# Altium schematic sheet PIC32MZDA.SchDoc
size B; SheetNumber: 2; SheetTotal: 5
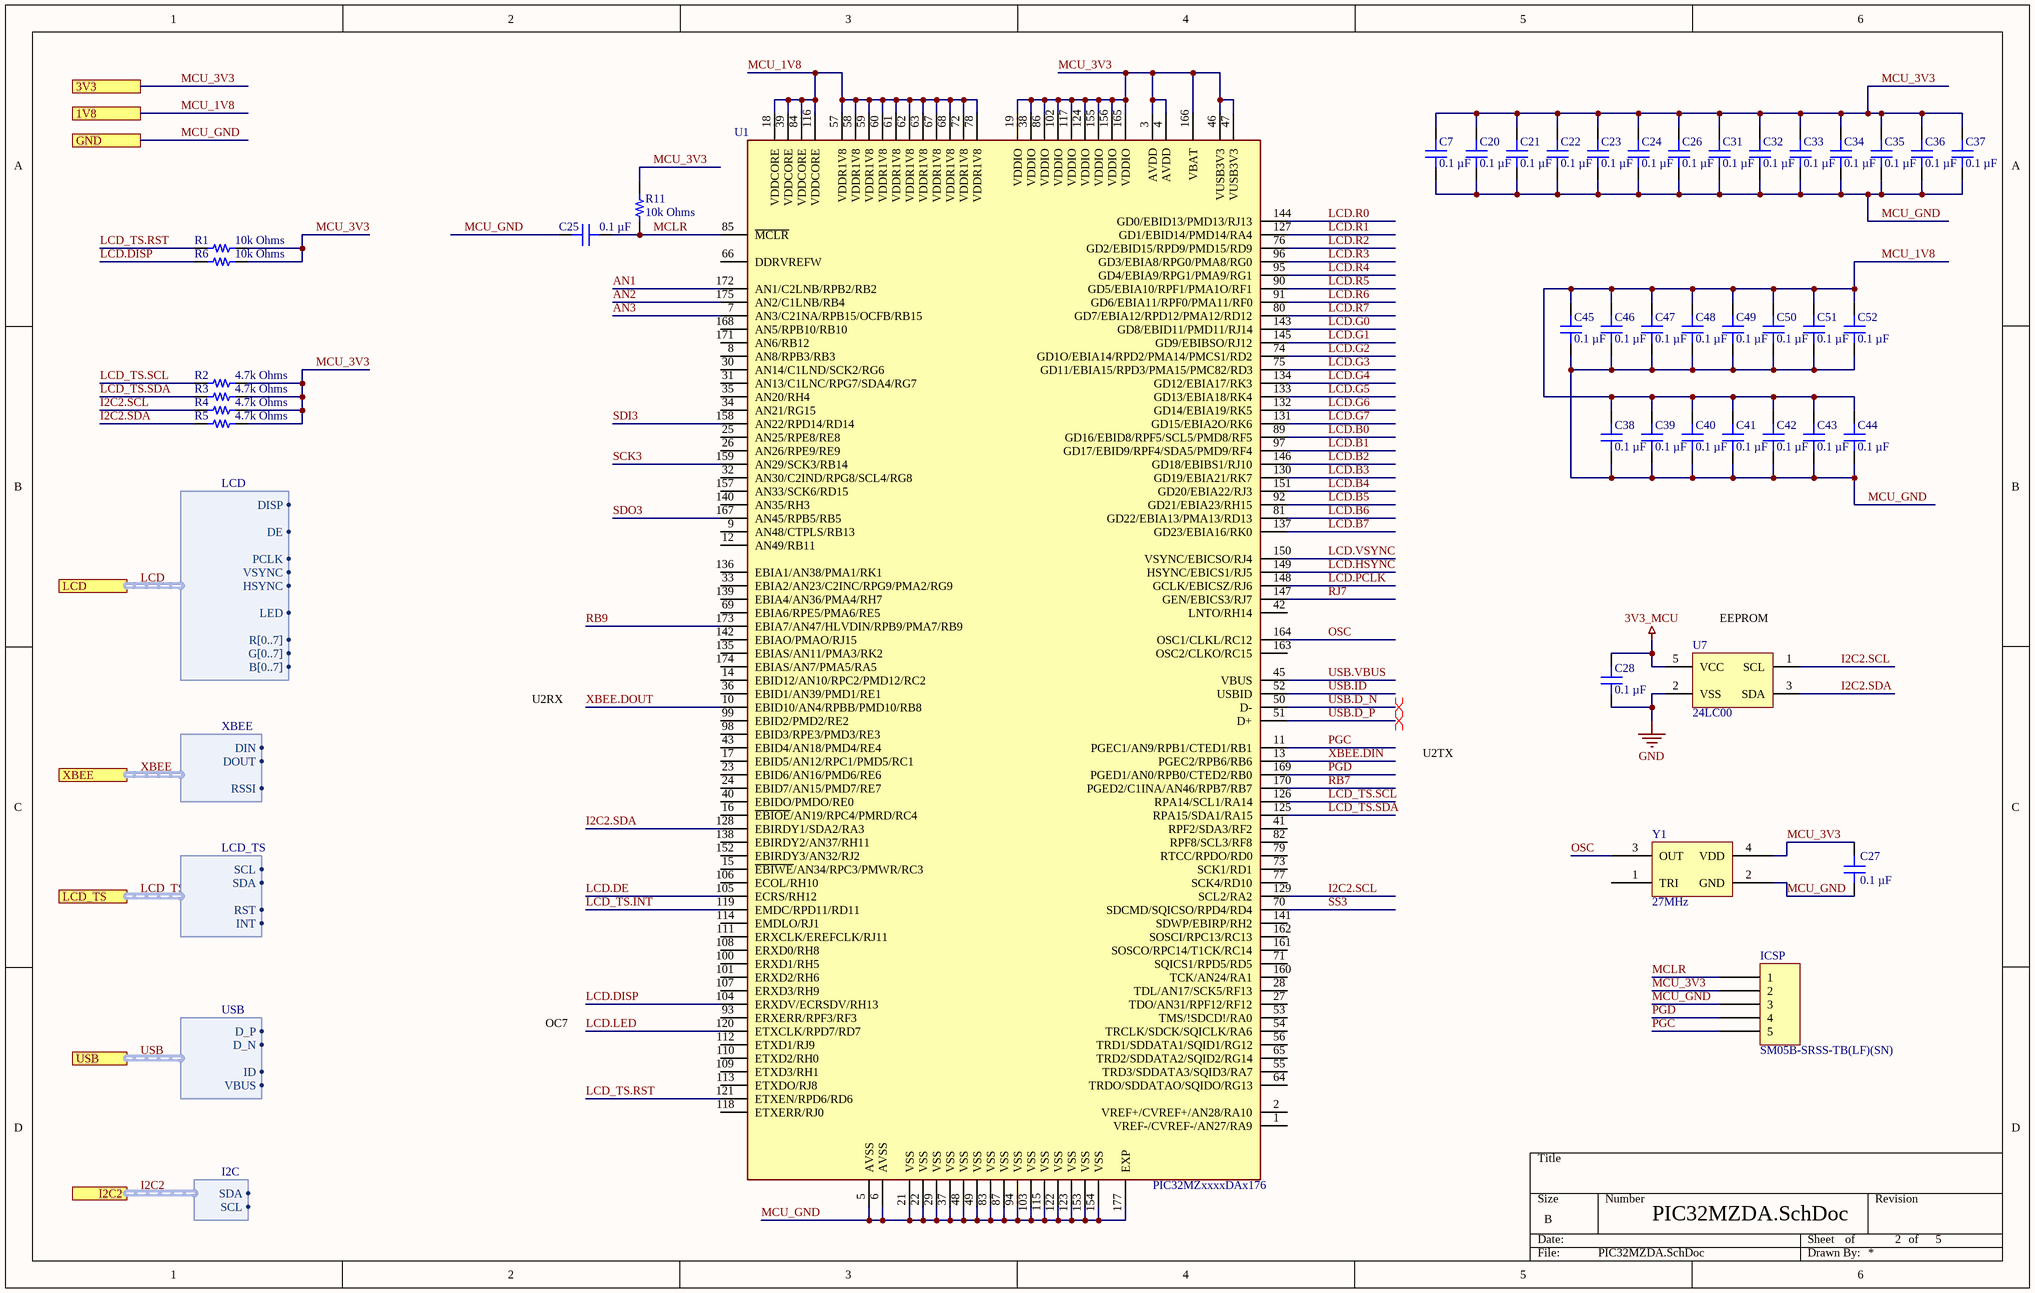
[diagram p0: PIC32MZDA.SchDoc]

## Parts
C7  0.1 µF  [CAP 0402_1005]
C20  0.1 µF  [CAP 0402_1005]
C21  0.1 µF  [CAP 0402_1005]
C22  0.1 µF  [CAP 0402_1005]
C23  0.1 µF  [CAP 0402_1005]
C24  0.1 µF  [CAP 0402_1005]
C25  0.1 µF  [CAP 0402_1005]
C26  0.1 µF  [CAP 0402_1005]
C27  0.1 µF  [CAP 0402_1005]
C28  0.1 µF  [CAP 0402_1005]
C31  0.1 µF  [CAP 0402_1005]
C32  0.1 µF  [CAP 0402_1005]
C33  0.1 µF  [CAP 0402_1005]
C34  0.1 µF  [CAP 0402_1005]
C35  0.1 µF  [CAP 0402_1005]
C36  0.1 µF  [CAP 0402_1005]
C37  0.1 µF  [CAP 0402_1005]
C38  0.1 µF  [CAP 0402_1005]
C39  0.1 µF  [CAP 0402_1005]
C40  0.1 µF  [CAP 0402_1005]
C41  0.1 µF  [CAP 0402_1005]
C42  0.1 µF  [CAP 0402_1005]
C43  0.1 µF  [CAP 0402_1005]
C44  0.1 µF  [CAP 0402_1005]
C45  0.1 µF  [CAP 0402_1005]
C46  0.1 µF  [CAP 0402_1005]
C47  0.1 µF  [CAP 0402_1005]
C48  0.1 µF  [CAP 0402_1005]
C49  0.1 µF  [CAP 0402_1005]
C50  0.1 µF  [CAP 0402_1005]
C51  0.1 µF  [CAP 0402_1005]
C52  0.1 µF  [CAP 0402_1005]
ICSP  SM05B-SRSS-TB(LF)(SN)  [JST SM05B-SRSS-TB]
R1  10k Ohms  [RES 0402_1005]
R2  4.7k Ohms  [RES 0402_1005]
R3  4.7k Ohms  [RES 0402_1005]
R4  4.7k Ohms  [RES 0402_1005]
R5  4.7k Ohms  [RES 0402_1005]
R6  10k Ohms  [RES 0402_1005]
R11  10k Ohms  [RES 0402_1005]
U1  PIC32MZxxxxDAx176  [QFP40P2200X2200X160-177N]
U7  24LC00  [SOT-23-5]
Y1  27MHz  [ABRACON ASD]

## Ports
1V8, 3V3, GND, I2C2 (harness I2C), LCD (harness LCD), LCD_TS (harness LCD_TS), USB (harness USB), XBEE (harness XBEE)

## Harnesses
USB: D_P, D_N, ID, VBUS
LCD: PCLK, DISP, VSYNC, HSYNC, DE, LED, R[0..7], G[0..7], B[0..7]
LCD_TS: RST, SCL, INT, SDA
I2C: SCL, SDA
XBEE: RSSI, DIN, DOUT

## Nets
3V3_MCU: C28.2 U7.5(VCC)
GND: C28.1 U7.2(VSS)
AN1: U1.172(AN1/C2LNB/RPB2/RB2)
AN2: U1.175(AN2/C1LNB/RB4)
AN3: U1.7(AN3/C21NA/RPB15/OCFB/RB15)
I2C2.SCL: R4.2 U1.129(SCL2/RA2) U7.1(SCL)
I2C2.SDA: R5.2 U1.128(EBIRDY1/SDA2/RA3) U7.3(SDA)
LCD.B0: U1.89(GD16/EBID8/RPF5/SCL5/PMD8/RF5)
LCD.B1: U1.97(GD17/EBID9/RPF4/SDA5/PMD9/RF4)
LCD.B2: U1.146(GD18/EBIBS1/RJ10)
LCD.B3: U1.130(GD19/EBIA21/RK7)
LCD.B4: U1.151(GD20/EBIA22/RJ3)
LCD.B5: U1.92(GD21/EBIA23/RH15)
LCD.B6: U1.81(GD22/EBIA13/PMA13/RD13)
LCD.B7: U1.137(GD23/EBIA16/RK0)
LCD.DE: U1.105(ECRS/RH12)
LCD.DISP: R6.2 U1.104(ERXDV/ECRSDV/RH13)
LCD.G0: U1.143(GD8/EBID11/PMD11/RJ14)
LCD.G1: U1.145(GD9/EBIBSO/RJ12)
LCD.G2: U1.74(GD1O/EBIA14/RPD2/PMA14/PMCS1/RD2)
LCD.G3: U1.75(GD11/EBIA15/RPD3/PMA15/PMC82/RD3)
LCD.G4: U1.134(GD12/EBIA17/RK3)
LCD.G5: U1.133(GD13/EBIA18/RK4)
LCD.G6: U1.132(GD14/EBIA19/RK5)
LCD.G7: U1.131(GD15/EBIA2O/RK6)
LCD.HSYNC: U1.149(HSYNC/EBICS1/RJ5)
LCD.LED: U1.120(ETXCLK/RPD7/RD7)
LCD.PCLK: U1.148(GCLK/EBICSZ/RJ6)
LCD.R0: U1.144(GD0/EBID13/PMD13/RJ13)
LCD.R1: U1.127(GD1/EBID14/PMD14/RA4)
LCD.R2: U1.76(GD2/EBID15/RPD9/PMD15/RD9)
LCD.R3: U1.96(GD3/EBIA8/RPG0/PMA8/RG0)
LCD.R4: U1.95(GD4/EBIA9/RPG1/PMA9/RG1)
LCD.R5: U1.90(GD5/EBIA10/RPF1/PMA1O/RF1)
LCD.R6: U1.91(GD6/EBIA11/RPF0/PMA11/RF0)
LCD.R7: U1.80(GD7/EBIA12/RPD12/PMA12/RD12)
LCD.VSYNC: U1.150(VSYNC/EBICSO/RJ4)
LCD_TS.INT: U1.119(EMDC/RPD11/RD11)
LCD_TS.RST: R1.2 U1.121(ETXEN/RPD6/RD6)
LCD_TS.SCL: R2.2 U1.126(RPA14/SCL1/RA14)
LCD_TS.SDA: R3.2 U1.125(RPA15/SDA1/RA15)
MCLR: C25.1 ICSP.1 R11.1 U1.85(~{MCLR})
MCU_1V8: C38.2 C39.2 C40.2 C41.2 C42.2 C43.2 C44.2 C45.2 C46.2 C47.2 C48.2 C49.2 C50.2 C51.2 C52.2 U1.18(VDDCORE) U1.39(VDDCORE) U1.57(VDDR1V8) U1.58(VDDR1V8) U1.59(VDDR1V8) U1.60(VDDR1V8) U1.61(VDDR1V8) U1.62(VDDR1V8) U1.63(VDDR1V8) U1.67(VDDR1V8) U1.68(VDDR1V8) U1.72(VDDR1V8) U1.78(VDDR1V8) U1.84(VDDCORE) U1.116(VDDCORE) ; port 1V8
MCU_3V3: C7.2 C20.2 C21.2 C22.2 C23.2 C24.2 C26.2 C27.2 C31.2 C32.2 C33.2 C34.2 C35.2 C36.2 C37.2 ICSP.2 R1.1 R2.1 R3.1 R4.1 R5.1 R6.1 R11.2 U1.3(AVDD) U1.4(AVDD) U1.19(VDDIO) U1.38(VDDIO) U1.46(VUSB3V3) U1.47(VUSB3V3) U1.86(VDDIO) U1.102(VDDIO) U1.117(VDDIO) U1.124(VDDIO) U1.155(VDDIO) U1.156(VDDIO) U1.165(VDDIO) U1.166(VBAT) Y1.4(VDD) ; port 3V3
MCU_GND: C7.1 C20.1 C21.1 C22.1 C23.1 C24.1 C25.2 C26.1 C27.1 C31.1 C32.1 C33.1 C34.1 C35.1 C36.1 C37.1 C38.1 C39.1 C40.1 C41.1 C42.1 C43.1 C44.1 C45.1 C46.1 C47.1 C48.1 C49.1 C50.1 C51.1 C52.1 ICSP.3 U1.5(AVSS) U1.6(AVSS) U1.21(VSS) U1.22(VSS) U1.29(VSS) U1.37(VSS) U1.48(VSS) U1.49(VSS) U1.83(VSS) U1.87(VSS) U1.94(VSS) U1.103(VSS) U1.115(VSS) U1.122(VSS) U1.123(VSS) U1.153(VSS) U1.154(VSS) U1.177(EXP) Y1.2(GND) ; port GND
OSC: U1.164(OSC1/CLKL/RC12) Y1.3(OUT)
PGC: ICSP.5 U1.11(PGEC1/AN9/RPB1/CTED1/RB1)
PGD: ICSP.4 U1.169(PGED1/AN0/RPB0/CTED2/RB0)
RB7: U1.170(PGED2/C1INA/AN46/RPB7/RB7)
RB9: U1.173(EBIA7/AN47/HLVDIN/RPB9/PMA7/RB9)
RJ7: U1.147(GEN/EBICS3/RJ7)
SCK3: U1.159(AN29/SCK3/RB14)
SDI3: U1.158(AN22/RPD14/RD14)
SDO3: U1.167(AN45/RPB5/RB5)
SS3: U1.70(SDCMD/SQICSO/RPD4/RD4)
USB.D_N: U1.50(D-)
USB.D_P: U1.51(D+)
USB.ID: U1.52(USBID)
USB.VBUS: U1.45(VBUS)
XBEE.DIN: U1.13(PGEC2/RPB6/RB6)
XBEE.DOUT: U1.10(EBID10/AN4/RPBB/PMD10/RB8)

Not connected (* = marked no-connect by the designer): U1 1(VREF-/CVREF-/AN27/RA9) 2(VREF+/CVREF+/AN28/RA10) 8(AN8/RPB3/RB3) 9(AN48/CTPLS/RB13) 12(AN49/RB11) 14(EBID12/AN10/RPC2/PMD12/RC2) 15(~{EBIWE}/AN34/RPC3/PMWR/RC3) 16(~{EBIOE}/AN19/RPC4/PMRD/RC4) 17(EBID5/AN12/RPC1/PMD5/RC1) 23(EBID6/AN16/PMD6/RE6) 24(EBID7/AN15/PMD7/RE7) 25(AN25/RPE8/RE8) 26(AN26/RPE9/RE9) 27(TDO/AN31/RPF12/RF12) 28(TDL/AN17/SCK5/RF13) 30(AN14/C1LND/SCK2/RG6) 31(AN13/C1LNC/RPG7/SDA4/RG7) 32(AN30/C2IND/RPG8/SCL4/RG8) 33(EBIA2/AN23/C2INC/RPG9/PMA2/RG9) 34(AN21/RG15) 35(AN20/RH4) 36(EBID1/AN39/PMD1/RE1) 40(EBIDO/PMDO/RE0) 41(RPF2/SDA3/RF2) 42(LNTO/RH14) 43(EBID4/AN18/PMD4/RE4) 53(TMS/!SDCD!/RA0) 54(TRCLK/SDCK/SQICLK/RA6) 55(TRD3/SDDATA3/SQID3/RA7) 56(TRD1/SDDATA1/SQID1/RG12) 64(TRDO/SDDATAO/SQIDO/RG13) 65(TRD2/SDDATA2/SQID2/RG14) 66(DDRVREFW) 69(EBIA6/RPE5/PMA6/RE5) 71(SQICS1/RPD5/RD5) 73(SCK1/RD1) 77(SCK4/RD10) 79(RTCC/RPDO/RD0) 82(RPF8/SCL3/RF8) 93(ERXERR/RPF3/RF3) 98(EBID3/RPE3/PMD3/RE3) 99(EBID2/PMD2/RE2) 100(ERXD1/RH5) 101(ERXD2/RH6) 106(ECOL/RH10) 107(ERXD3/RH9) 108(ERXD0/RH8) 109(ETXD3/RH1) 110(ETXD2/RH0) 111(ERXCLK/EREFCLK/RJ11) 112(ETXD1/RJ9) 113(ETXDO/RJ8) 114(EMDLO/RJ1) 118(ETXERR/RJ0) 135(EBIAS/AN11/PMA3/RK2) 136(EBIA1/AN38/PMA1/RK1) 138(EBIRDY2/AN37/RH11) 139(EBIA4/AN36/PMA4/RH7) 140(AN35/RH3) 141(SDWP/EBIRP/RH2) 142(EBIAO/PMAO/RJ15) 152(EBIRDY3/AN32/RJ2) 157(AN33/SCK6/RD15) 160(TCK/AN24/RA1) 161(SOSCO/RPC14/T1CK/RC14) 162(SOSCI/RPC13/RC13) 163(OSC2/CLKO/RC15) 168(AN5/RPB10/RB10) 171(AN6/RB12) 174(EBIAS/AN7/PMA5/RA5); Y1 1(TRI)

## Buses and harness runs
harness I2C2 = port I2C2
harness LCD = port LCD
harness LCD_TS = port LCD_TS
harness USB = port USB
harness XBEE = port XBEE

## Layout directives
differential pair: USB.D_N, USB.D_P

## Notes on the sheet
- (near U7) EEPROM
- U2RX
- U2TX
- OC7
- of

## Library data of the parts
C7 C20-C28 C31-C52 = C0402C104K4RACAUTO: CAP CER 0.1UF 16V X7R 0402; manufacturer: KEMET; Tolerance: ±10%; Part Number: C0402C104K4RACAUTO; Value: 0.1 µF; Applications: Automotive, Bypass, Decoupling; Capacitance: 0.1 µF; componentlink1description: Datasheet; componentlink1url: https://api.kemet.com/component-edge/download/specsheet/C0402C104K4RACAUTO.pdf; componentlink2description: DigiKey Link; componentlink2url: https://www.digikey.com/en/products/detail/kemet/C0402C104K4RACAUTO/3314827; Device Package: 0402 (1005 Metric); lastupdated: 8/14/2022 9:05:51 PM; Lifecycle Status: Active; Minimum Order: 1; Mounting Type: Surface Mount, MLCC; Operating Temperature: -55°C ~ 125°C; Package / Case: 0402 (1005 Metric); packaging: TapeAndReel; partid: 3024; Part Status: Active; price: 0.01; Ratings: AEC-Q200; series: SMD Auto X7R; Size / Dimension: 0.039" L x 0.020" W (1.00mm x 0.50mm); Supplier 1: DigiKey; Supplier Part Number 1: 399-6828-1-ND; Temperature Coefficient: X7R; Thickness (Max): 0.022" (0.55mm); Voltage - Rated: 16V
ICSP = SM05B-SRSS-TB(LF)(SN): CONN HEADER SMD R/A 5POS 1MM; Manufacturer: JST Sales America Inc.; Current Rating (Amps): 0.7A; Material Flammability Rating: UL94 V-0; Number of Positions: 5; Number of Positions Loaded: All; Pitch - Mating: 0.039" (1.00mm); Shrouding: Shrouded - 4 Wall; Style: Board to Cable/Wire; Voltage Rating: 50V; Part Number: SM05B-SRSS-TB(LF)(SN); ComponentLink1Description: Datasheet; ComponentLink1URL: http://www.jst-mfg.com/product/pdf/eng/eSH.pdf; ComponentLink2Description: DigiKey Link; ComponentLink2URL: http://digikey.com/product-detail/en/jst-sales-america-inc/SM05B-SRSS-TB-LF-SN/455-1805-1-ND/926876; Connector Type: Header; Contact Finish - Mating: Tin; Contact Finish - Post: Tin; Contact Material: Copper Alloy; Contact Shape: Square; Contact Type: Male Pin; Fastening Type: Push-Pull; Features: Solder Retention; Insulation Color: Natural; Insulation Height: 0.114" (2.90mm); Insulation Material: Polyamide (PA), Nylon; LastUpdated: 1/12/2020 11:42:04 PM; Lifecycle Status: Active; Minimum Order: 1; Mounting Type: Surface Mount, Right Angle; Number of Rows: 1; Operating Temperature: -25°C ~ 85°C; Packaging: TapeAndReel; PartId: 63; Part Status: Active; Price: 0.32; Series: SR; Supplier 1: DigiKey; Supplier Part Number 1: 455-1805-1-ND; Termination: Solder
R1-R6 R11 = CRCW0402330RJNEDC: RES 330 OHM 5% 1/16W 0402; Manufacturer: Vishay Dale; Power (Watts): 0.063W, 1/16W; Resistance: 330 Ohms; Temperature Coefficient: ±200ppm/°C; Part Number: CRCW0402330RJNEDC; ComponentLink1Description: Datasheet; ComponentLink1URL: http://www.vishay.com/docs/28773/crcwce3.pdf; ComponentLink2Description: DigiKey Link; ComponentLink2URL: https://www.digikey.com/en/products/detail/vishay-dale/CRCW0402330RJNEDC/7928545; Composition: Thick Film; Device Package: 0402 (1005 Metric); Height - Seated (Max): 0.014" (0.35mm); LastUpdated: 8/14/2022 9:23:31 PM; Lifecycle Status: Active; Minimum Order: 1; Number of Terminations: 2; Operating Temperature: -55°C ~ 155°C; Package / Case: 0402 (1005 Metric); Packaging: CutTape; PartId: 15989; Part Status: Active; Price: 0.01; Series: CRCW-C; Size / Dimension: 0.039" L x 0.020" W (1.00mm x 0.50mm); Supplier 1: DigiKey; Supplier Part Number 1: 541-4123-1-ND; Supplier Device Package: 0402; Tolerance: ±5%
  R1 R6 R11: Value: 10k Ohms
  R2-R5: Value: 4.7k Ohms
U1 = PIC32MZxxxxDAx176: MIPS32Â® microAptivâ„¢ PICÂ® 32MZ DA Microcontroller IC 32-Bit 200MHz 2MB _2M x 8_ FLASH 176-LQFP _20x20_; MP: PIC32MZ2064DAH176-I/2J; MF: Microchip; Package: LQFP-176 Microchip; SnapEDA_Link: https://www.snapeda.com/parts/PIC32MZ2064DAH176-I/2J/Microchip/view-part/880359/?ref=snap; Availability: Unavailable; Price: None; Value: *
U7 = 24LC00: EEPROM
Y1 = ASD3-27.000MHZ-EC-T: XTAL OSC XO 27.0000MHZ HCMOS SMD; Manufacturer: Abracon LLC; Base Resonator: Crystal; Current - Supply (Max): 4mA; Frequency Stability: ±50ppm; Function: Enable/Disable; Voltage - Supply: 1.8V; Part Number: ASD3-27.000MHZ-EC-T; ComponentLink1Description: Datasheet; ComponentLink1URL: https://abracon.com/Oscillators/ASDseries.pdf; ComponentLink2Description: DigiKey Link; ComponentLink2URL: http://digikey.com/product-detail/en/abracon-llc/ASD3-27.000MHZ-EC-T/535-9608-1-ND/1237075; Frequency: 27MHz; Height - Seated (Max): 0.039" (1.00mm); LastUpdated: 9/14/2022 8:37:45 AM; Lifecycle Status: Active; Minimum Order: 1; Mounting Type: Surface Mount; Operating Temperature: -20°C ~ 70°C; Output: HCMOS; Package / Case: 4-SMD, No Lead; Packaging: TapeAndReel; PartId: 4; Part Status: Active; Price: 1.74; Series: ASD; Size / Dimension: 0.098" L x 0.079" W (2.50mm x 2.00mm); Supplier 1: DigiKey; Supplier Part Number 1: 535-9608-1-ND; Type: XO (Standard); Value: 27MHz